# EAGLE design MotherboardV2.0.1 (EAGLE 7.2.0)

## Sheet 1 of 8: LATHCING CIRCUIT
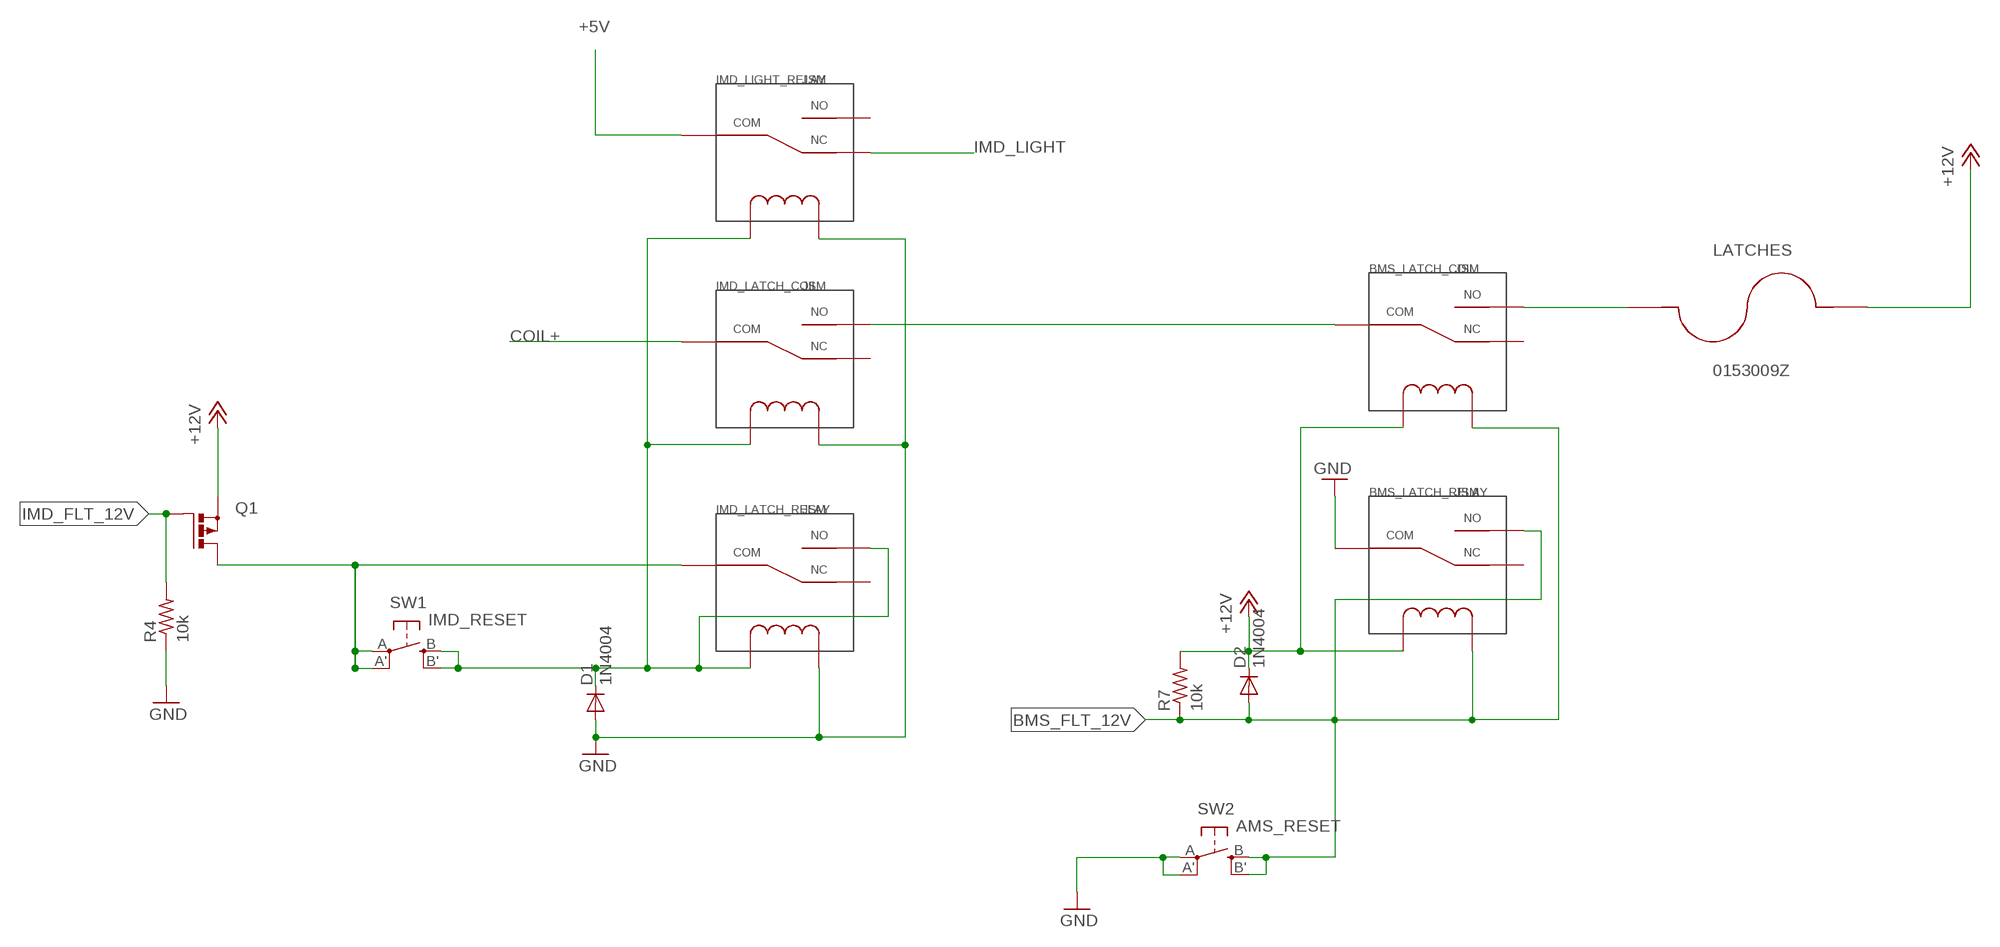
[diagram p0: schematic, sheet 1]

### Parts
BMS_LATCH_COIL  JSM  [JS-M]
BMS_LATCH_RELAY  JSM  [JS-M]
D1  1N4004  [DO41-10]
D2  1N4004  [DO41-10]
IMD_LATCH_COIL  JSM  [JS-M]
IMD_LATCH_RELAY  JSM  [JS-M]
IMD_LIGHT_RELAY  JSM  [JS-M]
LATCHES  0153009Z  [MINIFUSEHOLDER]
Q1  PMOSFET_PTO220BV  [TO220BV]
R4  10k  R-US_0207/9  [0207/9]
R7  10k  R-US_0207/9  [0207/9]
SW1  IMD_RESET  SPST_TACT-EVQQ2  [EVQ-Q2]
SW2  AMS_RESET  SPST_TACT-EVQQ2  [EVQ-Q2]

### Nets
+5V: IMD_LIGHT_RELAY.COM ; also sheet 2,5,6,7
+12V: BMS_LATCH_COIL.COIL1 BMS_LATCH_RELAY.COIL1 D2.C LATCHES.P$2 Q1.S R7.2 ; also sheet 2,3,4,6
BMS_FLT_12V: BMS_LATCH_COIL.COIL2 BMS_LATCH_RELAY.COIL2 BMS_LATCH_RELAY.NO D2.A R7.1 SW2.B'(S1) SW2.B(S) ; also sheet 2,4,7
COIL+: IMD_LATCH_COIL.COM ; also sheet 2
GND: BMS_LATCH_RELAY.COM D1.A IMD_LATCH_COIL.COIL2 IMD_LATCH_RELAY.COIL2 IMD_LIGHT_RELAY.COIL2 R4.1 SW2.A'(P1) SW2.A(P) ; also sheet 2,3,4,5,6,7
IMD_FLT_12V: Q1.G R4.2 ; also sheet 2,7
IMD_LATCH_SW1: IMD_LATCH_RELAY.COM Q1.D SW1.A'(P1) SW1.A(P) ; also sheet 2
IMD_LATCH_SW2: D1.C IMD_LATCH_COIL.COIL1 IMD_LATCH_RELAY.COIL1 IMD_LATCH_RELAY.NO IMD_LIGHT_RELAY.COIL1 SW1.B'(S1) SW1.B(S) ; also sheet 2
IMD_LIGHT: IMD_LIGHT_RELAY.NC
N$11: BMS_LATCH_COIL.COM IMD_LATCH_COIL.NO
N$35: BMS_LATCH_COIL.NO LATCHES.P$1
Unconnected: BMS_LATCH_COIL.NC BMS_LATCH_RELAY.NC IMD_LATCH_COIL.NC IMD_LATCH_RELAY.NC IMD_LIGHT_RELAY.NO

## Sheet 2 of 8: CONNECTORS
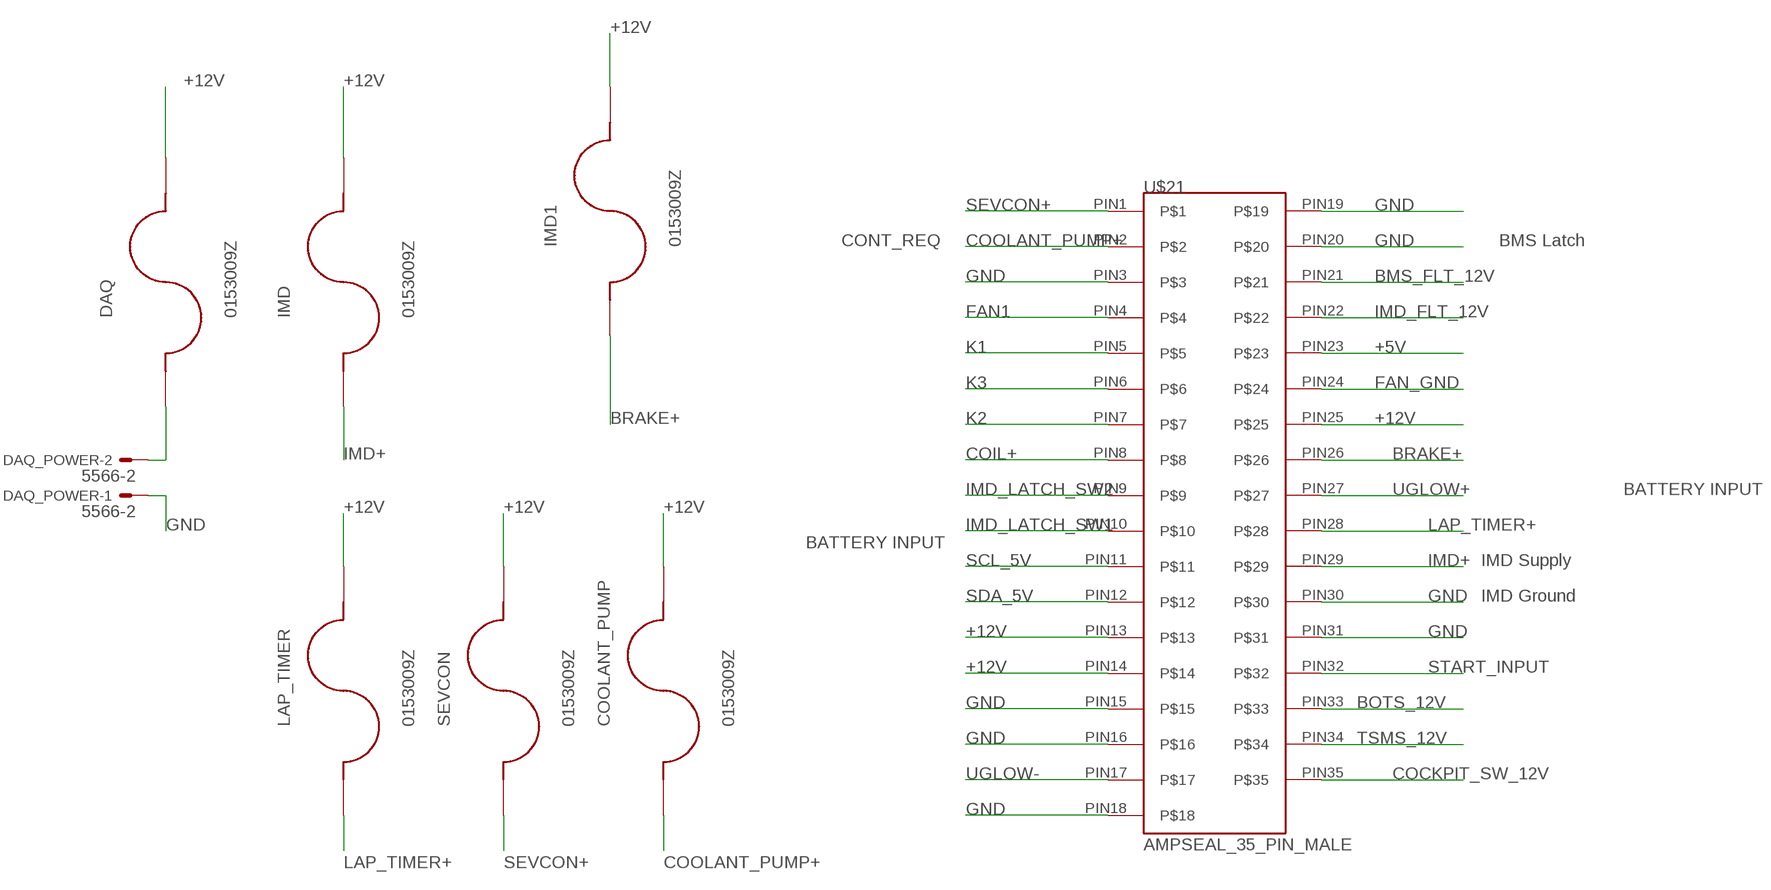
[diagram p1: schematic, sheet 2]

### Parts
COOLANT_PUMP  0153009Z  [MINIFUSEHOLDER]
DAQ  0153009Z  [MINIFUSEHOLDER]
DAQ_POWER  5566-2  [5566-2]
IMD  0153009Z  [MINIFUSEHOLDER]
IMD1  0153009Z  [MINIFUSEHOLDER]
LAP_TIMER  0153009Z  [MINIFUSEHOLDER]
SEVCON  0153009Z  [MINIFUSEHOLDER]
U$21  AMPSEAL_35_PIN_MALE  [AMPSEAL_35_PIN_MALE]

### Nets
+5V: U$21.PIN23 ; also sheet 1,5,6,7
+12V: COOLANT_PUMP.P$2 DAQ.P$2 IMD1.P$2 IMD.P$2 LAP_TIMER.P$2 SEVCON.P$2 U$21.PIN13 U$21.PIN14 U$21.PIN25 ; also sheet 1,3,4,6
BMS_FLT_12V: U$21.PIN21 ; also sheet 1,4,7
BOTS_12V: U$21.PIN33 ; also sheet 7
BRAKE+: IMD1.P$1 U$21.PIN26
COCKPIT_SW_12V: U$21.PIN35 ; also sheet 7
COIL+: U$21.PIN8 ; also sheet 1
COOLANT_PUMP+: COOLANT_PUMP.P$1 U$21.PIN2
DAQ+: DAQ.P$1 DAQ_POWER.2
FAN1: U$21.PIN4 ; also sheet 4
FAN_GND: U$21.PIN24 ; also sheet 4
GND: DAQ_POWER.1 U$21.PIN3 U$21.PIN15 U$21.PIN16 U$21.PIN18 U$21.PIN19 U$21.PIN20 U$21.PIN30 U$21.PIN31 ; also sheet 1,3,4,5,6,7
IMD+: IMD.P$1 U$21.PIN29
IMD_FLT_12V: U$21.PIN22 ; also sheet 1,7
IMD_LATCH_SW1: U$21.PIN10 ; also sheet 1
IMD_LATCH_SW2: U$21.PIN9 ; also sheet 1
K1: U$21.PIN5 ; also sheet 4
K2: U$21.PIN7 ; also sheet 4
K3: U$21.PIN6 ; also sheet 4
LAP_TIMER+: LAP_TIMER.P$1 U$21.PIN28
SCL_5V: U$21.PIN11 ; also sheet 5
SDA_5V: U$21.PIN12 ; also sheet 5
SEVCON+: SEVCON.P$1 U$21.PIN1
START_INPUT: U$21.PIN32 ; also sheet 5
TSMS_12V: U$21.PIN34 ; also sheet 7
UGLOW+: U$21.PIN27 ; also sheet 3
UGLOW-: U$21.PIN17 ; also sheet 3

### Notes on the sheet
- CONT_REQ | BMS Latch
- BATTERY INPUT
- BATTERY INPUT
- IMD Supply
- IMD Ground

## Sheet 3 of 8: OUTPUT RELAYS
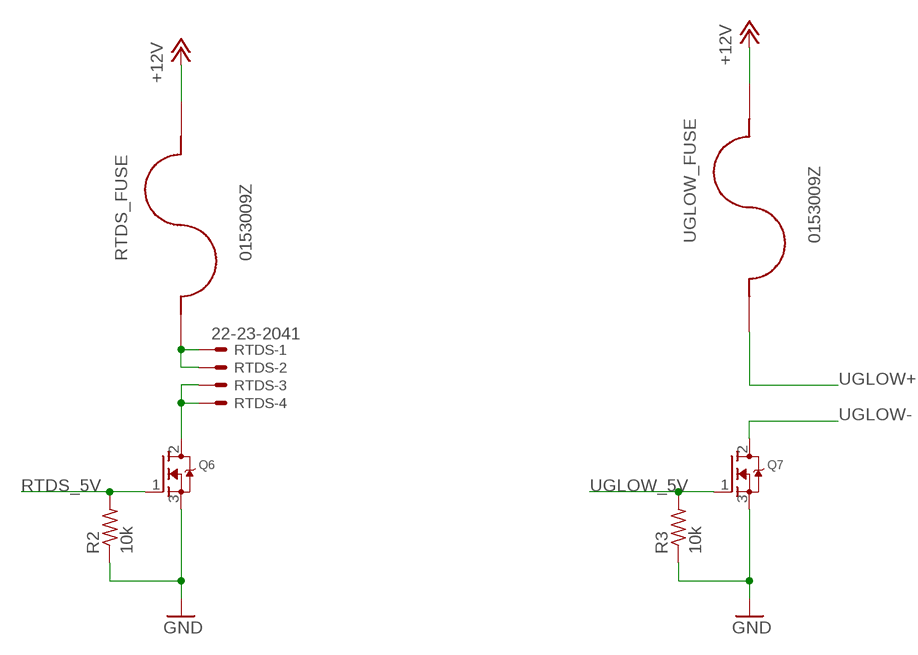
[diagram p2: schematic, sheet 3]

### Parts
Q6  MOSFET-NGDS_TO220V  [TO220V]
Q7  MOSFET-NGDS_TO220V  [TO220V]
R2  10k  R-US_0207/9  [0207/9]
R3  10k  R-US_0207/9  [0207/9]
RTDS  22-23-2041  [22-23-2041]
RTDS_FUSE  0153009Z  [MINIFUSEHOLDER]
UGLOW_FUSE  0153009Z  [MINIFUSEHOLDER]

### Nets
+12V: RTDS_FUSE.P$2 UGLOW_FUSE.P$2 ; also sheet 1,2,4,6
GND: Q6.3(S) Q7.3(S) R2.1 R3.1 ; also sheet 1,2,4,5,6,7
N$1: Q6.2(D) RTDS.3 RTDS.4
N$2: RTDS.1 RTDS.2 RTDS_FUSE.P$1
RTDS_5V: Q6.1(G) R2.2 ; also sheet 5
UGLOW+: UGLOW_FUSE.P$1 ; also sheet 2
UGLOW-: Q7.2(D) ; also sheet 2
UGLOW_5V: Q7.1(G) R3.2 ; also sheet 5

## Sheet 4 of 8: BMS CONNECTORS
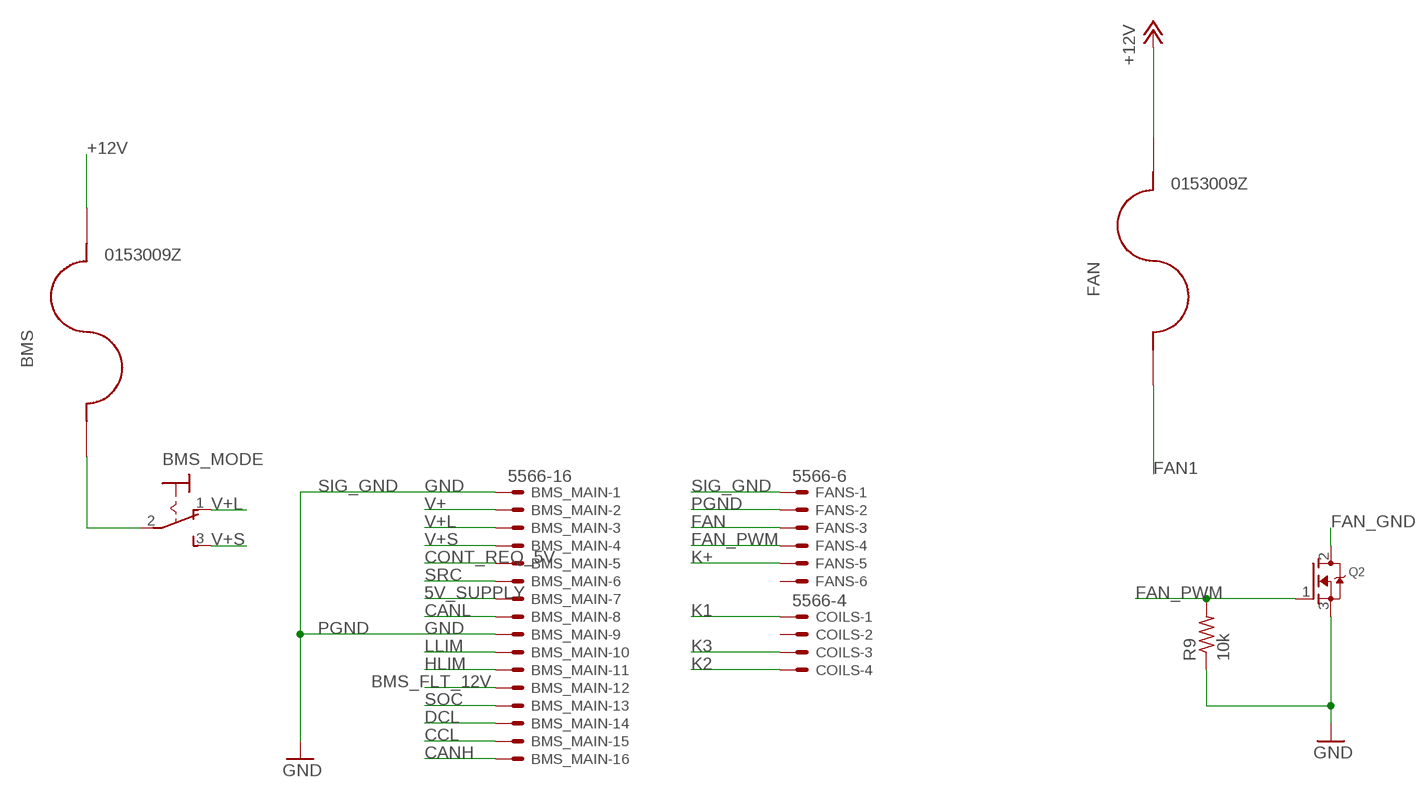
[diagram p3: schematic, sheet 4]

### Parts
BMS  0153009Z  [MINIFUSEHOLDER]
BMS_MAIN  5566-16  [5566-16]
BMS_MODE  320-916  [320-916]
COILS  5566-4  [5566-4]
FAN  0153009Z  [MINIFUSEHOLDER]
FANS  5566-6  [5566-6]
Q2  MOSFET-NGDS_TO220V  [TO220V]
R9  10k  R-US_0207/9  [0207/9]

### Nets
5V_SUPPLY: BMS_MAIN.7
+12V: BMS.P$2 FAN.P$2 ; also sheet 1,2,3,6
BMS_FLT_12V: BMS_MAIN.12 ; also sheet 1,2,7
CANH: BMS_MAIN.16
CANL: BMS_MAIN.8
CCL: BMS_MAIN.15
CONT_REQ_5V: BMS_MAIN.5 ; also sheet 5
DCL: BMS_MAIN.14
FAN: FANS.3
FAN1: FAN.P$1 ; also sheet 2
FAN_GND: Q2.2(D) ; also sheet 2
FAN_PWM: FANS.4 Q2.1(G) R9.2
GND: BMS_MAIN.1 BMS_MAIN.9 Q2.3(S) R9.1 ; also sheet 1,2,3,5,6,7
HLIM: BMS_MAIN.11
K1: COILS.1 ; also sheet 2
K2: COILS.4 ; also sheet 2
K3: COILS.3 ; also sheet 2
K+: FANS.5
LLIM: BMS_MAIN.10
N$3: BMS.P$1 BMS_MODE.2(P)
PGND: FANS.2
SIG_GND: FANS.1
SOC: BMS_MAIN.13 ; also sheet 5
SRC: BMS_MAIN.6
V+: BMS_MAIN.2
V+L: BMS_MAIN.3 BMS_MODE.1(O)
V+S: BMS_MAIN.4 BMS_MODE.3(S)
Unconnected: COILS.2 FANS.6

### Notes on the sheet
- SIG_GND
- PGND

## Sheet 5 of 8: VCU
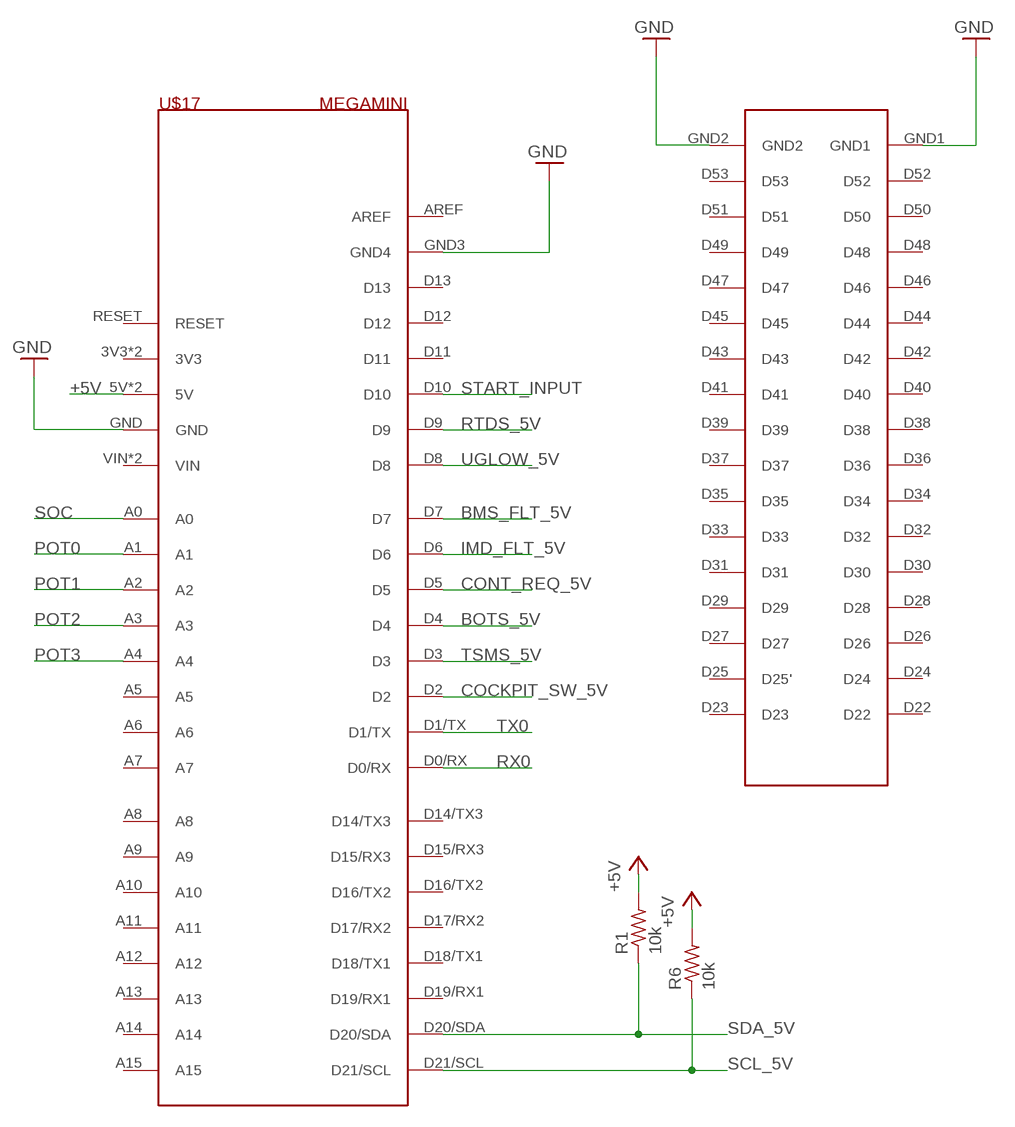
[diagram p4: schematic, sheet 5]

### Parts
R1  10k  R-US_0207/9  [0207/9]
R6  10k  R-US_0207/9  [0207/9]
U$17  MEGAMINI  [MEGAMINI]

### Nets
+5V: R1.2 R6.2 U$17.5V U$17.5V_2(5V) ; also sheet 1,2,6,7
BMS_FLT_5V: U$17.D7 ; also sheet 7
BOTS_5V: U$17.D4 ; also sheet 7
COCKPIT_SW_5V: U$17.D2 ; also sheet 7
CONT_REQ_5V: U$17.D5 ; also sheet 4
GND: U$17.GND U$17.GND1 U$17.GND2 U$17.GND3(GND4) ; also sheet 1,2,3,4,6,7
IMD_FLT_5V: U$17.D6 ; also sheet 7
POT0: U$17.A1
POT1: U$17.A2
POT2: U$17.A3
POT3: U$17.A4
RTDS_5V: U$17.D9 ; also sheet 3
RX0: U$17.D0/RX
SCL_5V: R6.1 U$17.D21/SCL ; also sheet 2
SDA_5V: R1.1 U$17.D20/SDA ; also sheet 2
SOC: U$17.A0 ; also sheet 4
START_INPUT: U$17.D10 ; also sheet 2
TSMS_5V: U$17.D3 ; also sheet 7
TX0: U$17.D1/TX
UGLOW_5V: U$17.D8 ; also sheet 3
Unconnected: U$17.3V3 U$17.3V3_2(3V3) U$17.A5 U$17.A6 U$17.A7 U$17.A8 U$17.A9 U$17.A10 U$17.A11 U$17.A12 U$17.A13 U$17.A14 U$17.A15 U$17.AREF U$17.D11 U$17.D12 U$17.D13 U$17.D14/TX3 U$17.D15/RX3 U$17.D16/TX2 U$17.D17/RX2 U$17.D18/TX1 U$17.D19/RX1 U$17.D22 U$17.D23 U$17.D24 U$17.D25(D25') U$17.D26 U$17.D27 U$17.D28 U$17.D29 U$17.D30 U$17.D31 U$17.D32 U$17.D33 U$17.D34 U$17.D35 U$17.D36 U$17.D37 U$17.D38 U$17.D39 U$17.D40 U$17.D41 U$17.D42 U$17.D43 U$17.D44 U$17.D45 U$17.D46 U$17.D47 U$17.D48 U$17.D49 U$17.D50 U$17.D51 U$17.D52 U$17.D53 U$17.RESET U$17.VIN U$17.VIN_2(VIN)

## Sheet 6 of 8: REGULATORS
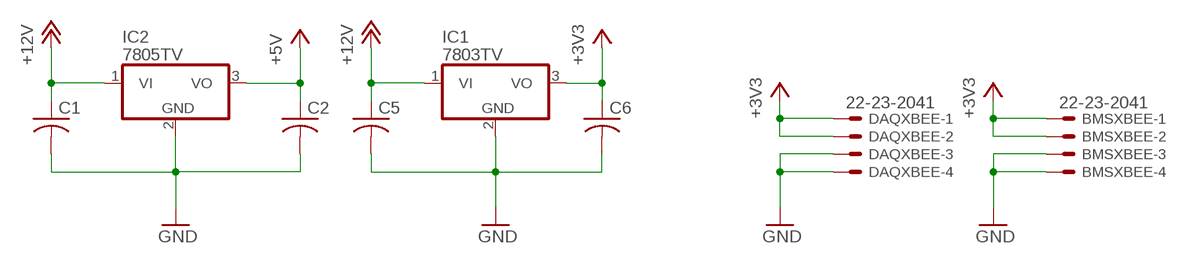
[diagram p5: schematic, sheet 6]

### Parts
BMSXBEE  22-23-2041  [22-23-2041]
C1  C-US050-024X044  [C050-024X044]
C2  C-US050-024X044  [C050-024X044]
C5  C-US050-024X044  [C050-024X044]
C6  C-US050-024X044  [C050-024X044]
DAQXBEE  22-23-2041  [22-23-2041]
IC1  7803TV  7805TV  [TO220V]
IC2  7805TV  [TO220V]

### Nets
+3V3: BMSXBEE.1 BMSXBEE.2 C6.1 DAQXBEE.1 DAQXBEE.2 IC1.3(VO)
+5V: C2.1 IC2.3(VO) ; also sheet 1,2,5,7
+12V: C1.1 C5.1 IC1.1(VI) IC2.1(VI) ; also sheet 1,2,3,4
GND: BMSXBEE.3 BMSXBEE.4 C1.2 C2.2 C5.2 C6.2 DAQXBEE.3 DAQXBEE.4 IC1.2(GND) IC2.2(GND) ; also sheet 1,2,3,4,5,7

## Sheet 7 of 8: LEVEL SHIFTING
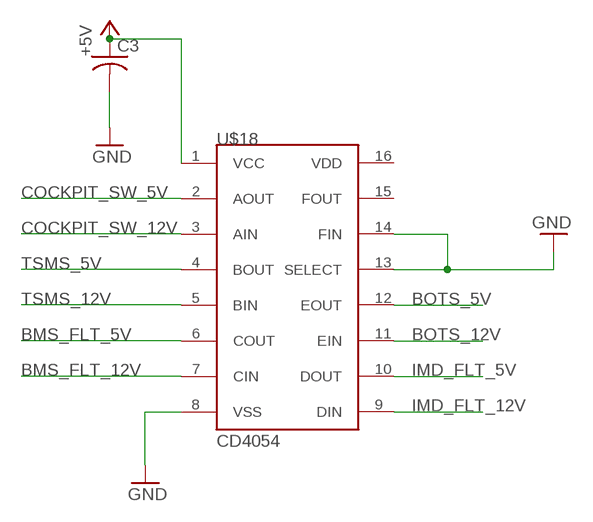
[diagram p6: schematic, sheet 7]

### Parts
C3  C-US050-024X044  [C050-024X044]
U$18  CD4054  [DIL16]

### Nets
+5V: C3.1 U$18.1(VCC) ; also sheet 1,2,5,6
BMS_FLT_5V: U$18.6(COUT) ; also sheet 5
BMS_FLT_12V: U$18.7(CIN) ; also sheet 1,2,4
BOTS_5V: U$18.12(EOUT) ; also sheet 5
BOTS_12V: U$18.11(EIN) ; also sheet 2
COCKPIT_SW_5V: U$18.2(AOUT) ; also sheet 5
COCKPIT_SW_12V: U$18.3(AIN) ; also sheet 2
GND: C3.2 U$18.8(VSS) U$18.13(SELECT) U$18.14(FIN) ; also sheet 1,2,3,4,5,6
IMD_FLT_5V: U$18.10(DOUT) ; also sheet 5
IMD_FLT_12V: U$18.9(DIN) ; also sheet 1,2
TSMS_5V: U$18.4(BOUT) ; also sheet 5
TSMS_12V: U$18.5(BIN) ; also sheet 2
Unconnected: U$18.15(FOUT) U$18.16(VDD)

## Sheet 8 of 8

## Library data of the parts
BMS COOLANT_PUMP DAQ FAN IMD IMD1 LAP_TIMER LATCHES RTDS_FUSE SEVCON UGLOW_FUSE = littelfuse:0153009Z: http://www.digikey.com/product-search/en/circuit-protection/fuseholders/655422?k=01530009 MINI ATC, MINI ATO Blade fuse holder
BMS_LATCH_COIL BMS_LATCH_RELAY IMD_LATCH_COIL IMD_LATCH_RELAY IMD_LIGHT_RELAY = panasonic:JSM
BMS_MAIN = con-molex:5566-16: Mini FIT connector 16 pol Source: http://www.molex.com; OC_FARNELL: unknown; OC_NEWARK: unknown
BMS_MODE = switch:320-916: TOGGLE SWITCH distributor RS Components
BMSXBEE DAQXBEE RTDS = con-molex:22-23-2041: .100" (2.54mm) Center Header - 4 Pin; MF: MOLEX; MPN: 22-23-2041; OC_FARNELL: 1462920; OC_NEWARK: 38C0355
C1-C3 C5 C6 = adafruit:C-US: CAPACITOR, American symbol
COILS = con-molex:5566-4: Mini FIT connector 4 pol Source: http://www.molex.com; OC_FARNELL: unknown; OC_NEWARK: unknown
D1 D2 = adafruit:1N4004: DIODE General purpose 1N400x type rectifier (With bigger pads) http://www.ladyada.net/library/pcb/eaglelibrary.html
DAQ_POWER = con-molex:5566-2: Mini FIT connector 2 pol Source: http://www.molex.com; OC_FARNELL: 1822072; OC_NEWARK: unknown
FANS = con-molex:5566-6: Mini FIT connector 6 pol Source: http://www.molex.com; MPN: 95566-61002; OC_FARNELL: unknown; OC_NEWARK: 22K8620
IC1 IC2 = linear:78*: Positive VOLTAGE REGULATOR Source: http://cache.national.com/ds/LM/LM78L05.pdf http://www.fairchildsemi.com/ds/LM/LM7805.pdf
Q1 = transistor-power:PMOSFET_P: Power MOSFET P-Channel
Q2 Q6 Q7 = adafruit:MOSFET-N: N-Channel Mosfet 2N7002E - 60V 260mA SOT23 [Digikey: 2N7002ET1GOSTR-ND] - REEL BSH103 - 30V 850mA SOT23 [Digikey: 568-5013-1-ND]
R1-R4 R6 R7 R9 = adafruit:R-US_: RESISTOR, American symbol
SW1 SW2 = adafruit:SPST_TACT: SMT 6mm switch, EVQQ2 series http://www.ladyada.net/library/eagle
U$17 = Mega-mini:MEGAMINI
U$18 = texas:CD4054
U$21 = AMPSEAL 35 PIN MALE:AMPSEAL_35_PIN_MALE

## Board
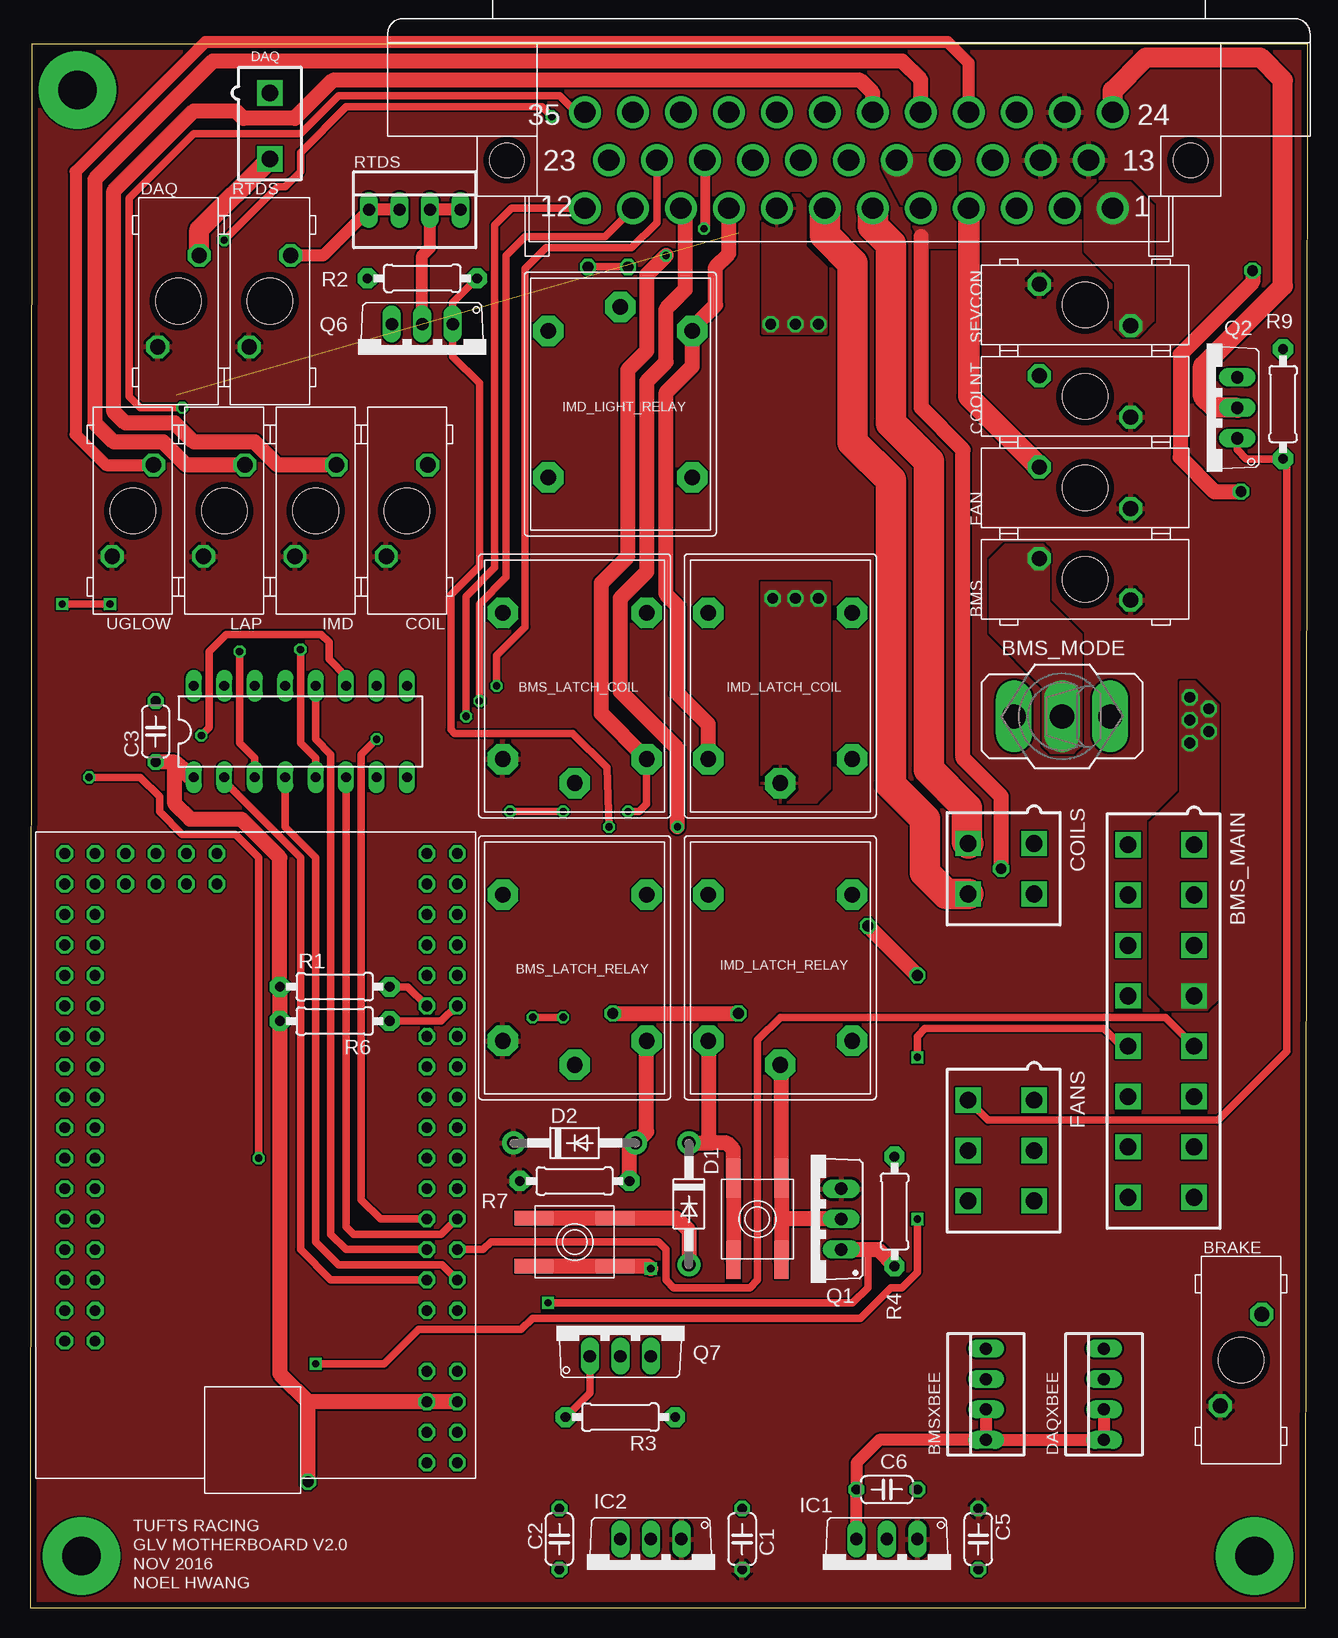
[diagram p7: board, top side]
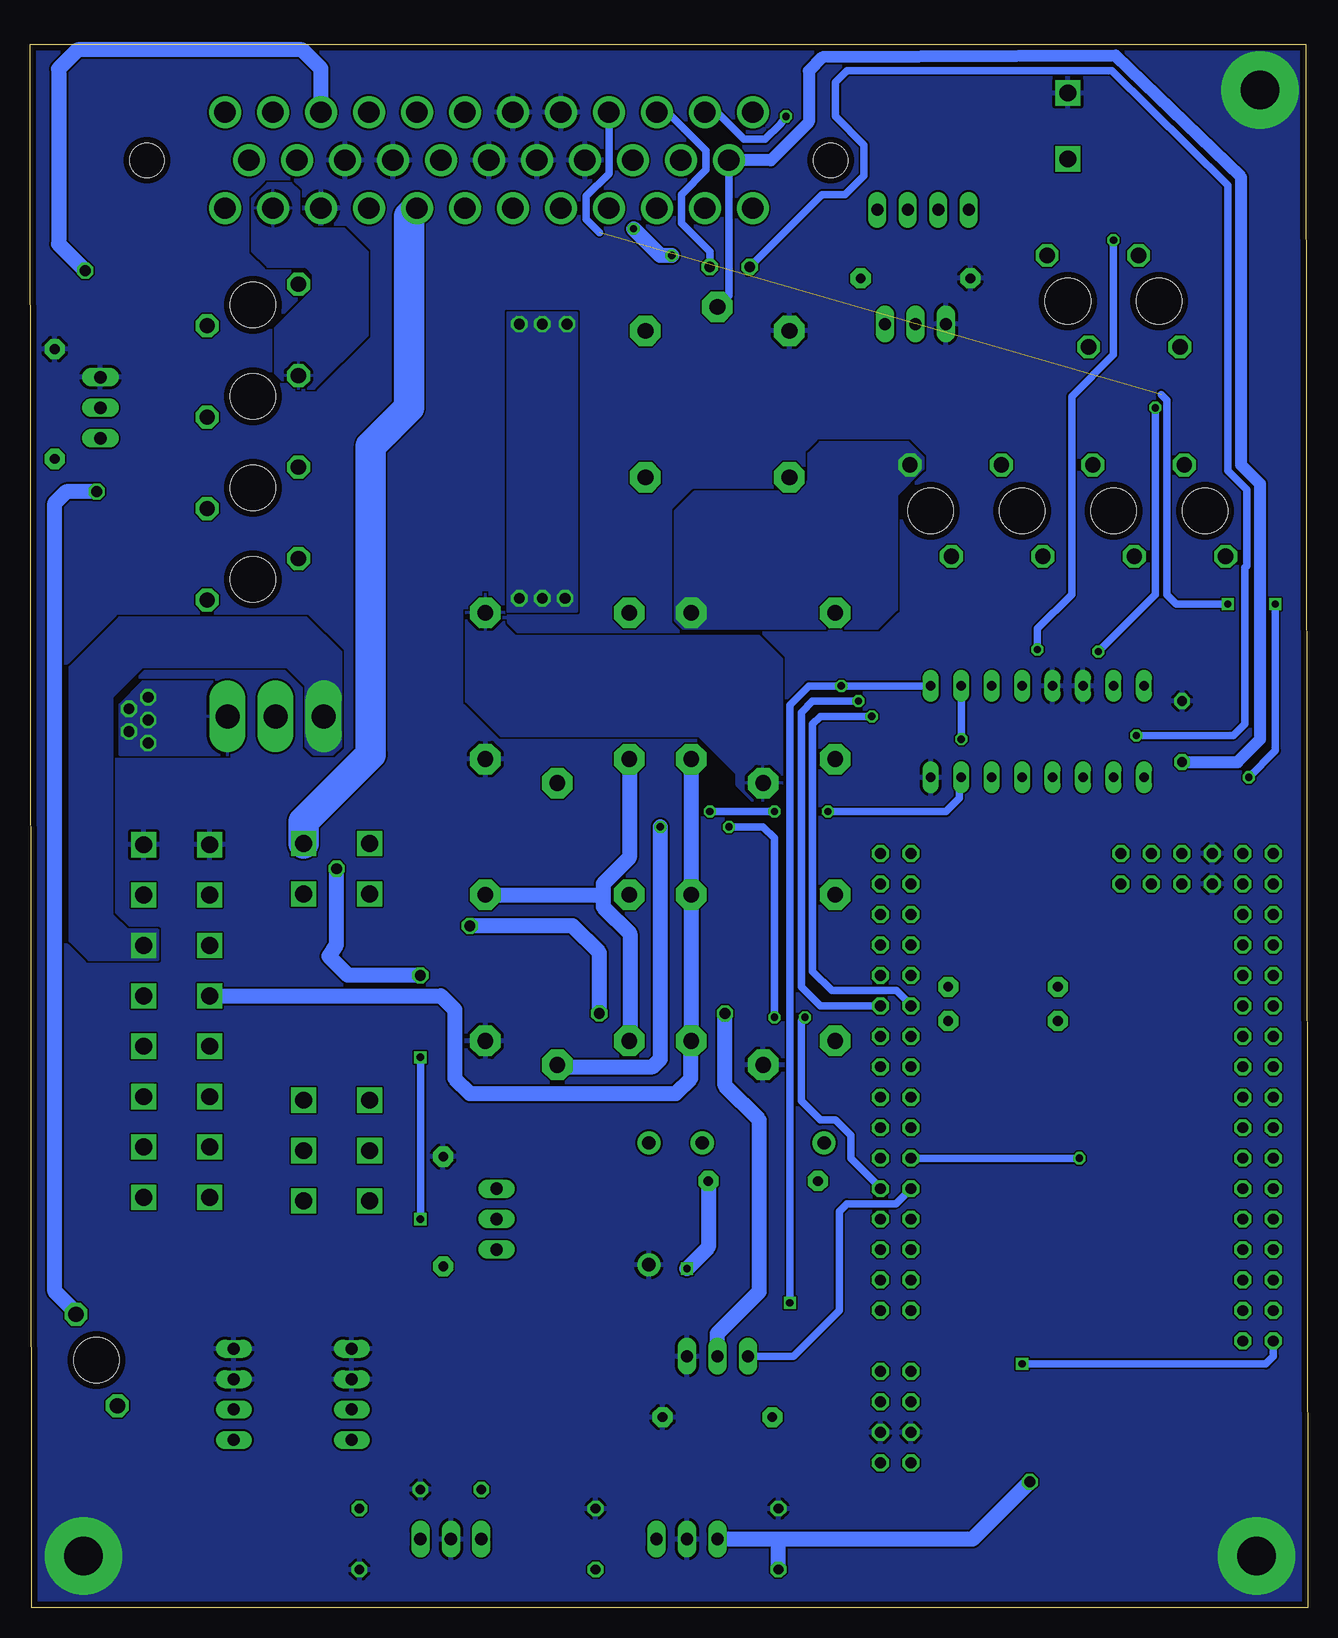
[diagram p8: board, bottom side, seen from below]

Size 106.52 x 130.33 mm. Coordinates in mm from the lower left corner, seen from the top.
Outline: 0,0 106.36,0 106.52,130.33 0.16,130.33 0,0
Copper layers (1*16): Top 0.035mm / dielectric 1.5mm / Bottom 0.035mm
Design rules "3pcb": minimum track width 6mil, minimum drill 8mil, track to track 6mil, track to pad 6mil, pad to pad 6mil, via to via 6mil, smd to smd 6mil, copper to edge 20mil, drill to drill 6mil, minimum pad ring 10mil, minimum via ring 8mil, stop-mask expansion 4mil, vias tented up to drill 0mil, thermal gap 10mil

### Footprints (pad centres in the part's own frame; a part is rotated, then mirrored left to right if it is on the bottom)
MINIFUSEHOLDER = drill 1.27 octagon: P$1 1.727,3.81; P$2 -1.727,-3.81 | hole 3.785: 0,0
JS-M = drill 1.3 pad 2.54 octagon: COIL1 -6.1,6; COIL2 -6.1,-6; COM -8.1,0; NC 6.1,6; NO 6.1,-6
5566-16 = drill 1.4 square: 1 14.7,-2.75; 2 10.5,-2.75; 3 6.3,-2.75; 4 2.1,-2.75; 5 -2.1,-2.75; 6 -6.3,-2.75; 7 -10.5,-2.75; 8 -14.7,-2.75; 9 14.7,2.75; 10 10.5,2.75; 11 6.3,2.75; 12 2.1,2.75; 13 -2.1,2.75; 14 -6.3,2.75; 15 -10.5,2.75; 16 -14.7,2.75
320-916 = drill 2.007 long: 1 0,4.013; 2 0,0; 3 0,-4.013
22-23-2041 = drill 1 long: 1 -3.81,0; 2 -1.27,0; 3 1.27,0; 4 3.81,0
C050-024X044 = drill 0.813 octagon: 1 -2.54,0; 2 2.54,0
5566-4 = drill 1.4 square: 1 2.1,-2.75; 2 -2.1,-2.75; 3 2.1,2.75; 4 -2.1,2.75
DO41-10 = drill 1.118 pad 1.93: A 5.08,0; C -5.08,0
5566-2 = drill 1.4 square: 1 0,-2.75; 2 0,2.75
5566-6 = drill 1.4 square: 1 4.2,-2.75; 2 0,-2.75; 3 -4.2,-2.75; 4 4.2,2.75; 5 0,2.75; 6 -4.2,2.75
TO220V = drill 1.016 long: 1 -2.54,-2.54; 2 0,-2.54; 3 2.54,-2.54
TO220BV = drill 1.016 long: D 0,-2.54; G -2.54,-2.54; S 2.54,-2.54
0207/9 = drill 0.813 pad 1.676 octagon: 1 -4.572,0; 2 4.572,0
EVQ-Q2 = smd 3.2 x 1.2: A -3.4,-2; A' 3.4,-2; B -3.4,2; B' 3.4,2
MEGAMINI = drill 0.9 octagon: 3V3 8.89,1.524; 3V3_2 8.89,4.064; 5V 6.35,1.524; 5V_2 6.35,4.064; A0 11.43,34.264; A1 11.43,31.724; A2 13.97,34.264; A3 13.97,31.724; A4 16.51,34.264; A5 16.51,31.724; A6 19.05,34.264; A7 19.05,31.724; A8 21.59,34.264; A9 21.59,31.724; A10 24.13,34.264; A11 24.13,31.724; A12 26.67,34.264; A13 26.67,31.724; A14 29.21,34.264; A15 29.21,31.724; AREF 31.75,34.264; D0/RX 13.97,4.064; D1/TX 13.97,1.524; D2 16.51,4.064; D3 16.51,1.524; D4 19.05,4.064; D5 19.05,1.524; D6 21.59,4.064; D7 21.59,1.524; D8 24.13,4.064; D9 24.13,1.524; D10 26.67,4.064; D11 26.67,1.524; D12 29.21,4.064; D13 29.21,1.524; D14/TX3 31.75,4.064; D15/RX3 31.75,1.524; D16/TX2 34.29,4.064; D17/RX2 34.29,1.524; D18/TX1 36.83,4.064; D19/RX1 36.83,1.524; D20/SDA 39.37,4.064; D21/SCL 39.37,1.524; D22 41.91,4.064; D23 41.91,1.524; D24 44.45,4.064; D25 44.45,1.524; D26 46.99,4.064; D27 46.99,1.524; D28 49.53,4.064; D29 49.53,1.524; D30 52.07,4.064; D31 52.07,1.524; D32 34.29,34.264; D33 34.29,31.724; D34 36.83,34.264; D35 36.83,31.724; D36 39.37,34.264; D37 39.37,31.724; D38 41.91,34.264; D39 41.91,31.724; D40 44.45,34.264; D41 44.45,31.724; D42 46.99,34.264; D43 46.99,31.724; D44 49.53,34.264; D45 49.53,31.724; D46 52.07,34.264; D47 52.07,31.724; D48 52.07,26.644; D49 49.53,26.644; D50 52.07,24.104; D51 49.53,24.104; D52 52.07,21.564; D53 49.53,21.564; GND 49.53,29.184; GND1 52.07,29.184; GND2 3.81,4.064; GND3 3.81,1.524; RESET 31.75,31.724; VIN 1.27,1.524; VIN_2 1.27,4.064
DIL16 = drill 0.813 long: 1 -8.89,-3.81; 2 -6.35,-3.81; 3 -3.81,-3.81; 4 -1.27,-3.81; 5 1.27,-3.81; 6 3.81,-3.81; 7 6.35,-3.81; 8 8.89,-3.81; 9 8.89,3.81; 10 6.35,3.81; 11 3.81,3.81; 12 1.27,3.81; 13 -1.27,3.81; 14 -3.81,3.81; 15 -6.35,3.81; 16 -8.89,3.81
AMPSEAL_35_PIN_MALE = drill 1.778 pad 2.54: PIN1 -22,4; PIN2 -18,4; PIN3 -14,4; PIN4 -10,4; PIN5 -6,4; PIN6 -2,4; PIN7 2,4; PIN8 6,4; PIN9 10,4; PIN10 14,4; PIN11 18,4; PIN12 22,4; PIN13 -20,0; PIN14 -16,0; PIN15 -12,0; PIN16 -8,0; PIN17 -4,0; PIN18 0,0; PIN19 4,0; PIN20 8,0; PIN21 12,0; PIN22 16,0; PIN23 20,0; PIN24 -22,-4; PIN25 -18,-4; PIN26 -14,-4; PIN27 -10,-4; PIN28 -6,-4; PIN29 -2,-4; PIN30 2,-4; PIN31 6,-4; PIN32 10,-4; PIN33 14,-4; PIN34 18,-4; PIN35 22,-4 | hole 2.85: -28.5,0; 28.5,0

### Placement (x,y rotation side)
BMS  87.95,85.72 90 top
BMS_LATCH_COIL  45.4,76.83 90 top
BMS_LATCH_RELAY  45.4,53.34 90 top
BMS_MAIN  94.3,48.9 90 top
BMS_MODE  86.04,74.3 90 top
BMSXBEE  79.69,17.78 90 top
C1  59.37,5.71 90 top
C2  44.13,5.71 90 top
C3  10.48,73.03 90 top
C5  79.06,5.71 270 top
C6  71.44,9.84 0 top
COILS  80.96,61.59 90 top
COOLANT_PUMP  87.95,100.97 90 top
D1  54.93,33.66 270 top
D2  45.4,38.73 0 top
DAQ  12.38,108.9 0 top
DAQ_POWER  20,123.51 180 top
DAQXBEE  89.53,17.78 90 top
FAN  87.95,93.34 90 top
FANS  80.96,38.1 90 top
IC1  71.44,3.17 180 top
IC2  51.75,3.17 180 top
IMD  23.81,91.44 0 top
IMD1  100.97,20.64 0 top
IMD_LATCH_COIL  62.55,76.83 90 top
IMD_LATCH_RELAY  62.55,53.34 90 top
IMD_LIGHT_RELAY  49.21,100.33 270 top
LAP_TIMER  16.19,91.44 0 top
LATCHES  31.43,91.44 0 top
Q1  65.09,32.38 90 top
Q2  98.11,100.01 90 top
Q6  32.7,104.46 180 top
Q7  49.21,23.5 0 top
R1  25.4,51.75 180 top
R2  32.7,110.81 0 top
R3  49.21,15.88 180 top
R4  72.07,33.02 270 top
R6  25.4,48.9 180 top
R7  45.4,35.56 180 top
R9  104.46,100.33 270 top
RTDS  32.07,116.52 0 top
RTDS_FUSE  20,108.9 0 top
SEVCON  87.95,108.58 270 top
SW1  60.64,32.38 90 top
SW2  45.4,30.48 180 top
U$17  37.15,10.79 90 top
U$18  22.54,73.03 0 top
U$21  68.26,120.65 180 top
UGLOW_FUSE  8.57,91.44 0 top

### Tracks (layer width: path | path; a pad name or v marks a point on that pad's centre or on a via)
+3V3
  Top 1.016: IC1.3 C6.1 68.9,12.06 70.8,13.97 BMSXBEE.1 | BMSXBEE.1 DAQXBEE.1 DAQXBEE.2 | BMSXBEE.2 BMSXBEE.1
+5V  (via drill 0.6, 0.9)
  Top 1.27: v23.18,10.48 23.18,16.83 23.34,16.99 | U$17.5V U$17.5V_2 23.5,17.14 23.34,16.99 | 12.06,70.48 12.06,66.99 13.34,65.72 17.62,65.72 20.83,62.52 R1.2 R6.2 20.83,19.49 23.34,16.99 | 12.06,70.48 U$18.1 13.34,69.22 12.06,70.48 | 12.06,70.48 C3.1
  Bottom 0.61: U$21.PIN23 48.26,109.38 IMD_LIGHT_RELAY.COM
  Bottom 1.016: U$21.PIN23 44.77,120.65 41.59,123.83 41.59,128.11 40.48,129.22 16.03,129.38 5.56,119.22 5.56,95.25 3.97,93.66 3.97,72.39 5.87,70.48 C3.1
  Bottom 1.27: v23.18,10.48 27.94,5.71 43.82,5.71 | 43.82,5.71 IC2.3 | C2.1 44.13,5.4 43.82,5.71
  other vias: 10.48,70.48
+12V
  pour Top (rank 2): -1.59,135.57 -1.59,-20.64 110.17,-20.32 110.17,135.89
BMS_FLT_5V
  Top 0.61: U$18.6 26.35,31.75 26.99,31.11 34.29,31.11 35.56,32.38 U$17.D7
BMS_FLT_12V  (via drill 0.6)
  Top 0.61: BMS_LATCH_COIL.COIL2 51.4,66.99 50.77,66.36 v49.85,66.36 | v44.45,66.36 v40,66.36
  Top 0.813: U$21.PIN21 56.26,115 v56.2,114.94
  Top 1.27: SW2.B' SW2.B 51.53,28.48 v51.75,28.26 | R7.1 49.97,38.23 D2.A 51.4,39.66 BMS_LATCH_RELAY.COIL2 | BMS_LATCH_COIL.COIL2 47.63,74.51 47.63,85.41 49.85,87.63 49.85,103.19 51.43,104.78 51.43,111.12 v53.02,112.71
  Bottom 0.61: v49.85,66.36 v44.45,66.36 | v40,66.36 30.16,66.36 29.05,67.47 29.05,69.06 U$18.7
  Bottom 1.27: R7.1 49.97,30.04 v51.75,28.26 | BMS_LATCH_COIL.COIL2 BMS_LATCH_RELAY.NO BMS_LATCH_RELAY.COIL2 51.43,47.27 51.43,44.13 52.71,42.86 69.85,42.86 71.12,44.13 71.12,49.85 72.27,50.99 BMS_MAIN.12 | v53.02,112.71 53.97,112.71 v56.2,114.94
BOTS_5V
  Top 0.61: U$18.12 23.81,72.39 25.08,71.12 25.08,31.11 26.35,29.84 U$17.D4
BOTS_12V  (via drill 0.6, 0.9)
  Top 0.61: v49.85,111.76 v46.51,111.76 | U$18.11 26.35,77.63 24.92,79.06 24.92,80.49 24.29,81.12 16.35,81.12 14.92,79.69 14.92,73.34 v14.29,72.71
  Bottom 0.61: U$21.PIN33 53.37,124.65 50.17,121.44 50.17,119.86 52.23,117.79 52.23,115.41 49.85,113.03 v49.85,111.76 | v46.51,111.76 40.48,117.79 38.58,117.79 36.99,119.38 36.99,121.92 39.37,124.3 39.37,127.16 38.42,128.11 16.35,128.11 6.67,118.59 6.67,94.77 5.08,93.19 5.08,86.84 5.24,86.68 5.24,73.66 6.19,72.71 v14.29,72.71
BRAKE+  (via drill 0.9)
  Top 1.27: v101.92,111.44 101.92,110.49 95.88,104.46 95.88,95.89 98.74,93.03 v100.97,93.03
  Bottom 1.27: IMD1.P$1 102.55,24.45 104.46,26.35 104.46,92.08 103.5,93.03 v100.97,93.03 | U$21.PIN26 82.26,128.3 83.82,129.86 102.55,129.86 104.14,128.27 104.14,113.67 v101.92,111.44
COCKPIT_SW_5V
  Top 0.61: U$18.2 16.19,68.9 22.54,62.55 22.54,29.84 25.08,27.3 U$17.D2
COCKPIT_SW_12V  (via drill 0.6)
  Top 0.61: U$18.3 18.73,70.8 17.46,72.07 v17.46,79.69 | U$21.PIN35 45.53,124.65 44.13,126.05 25.72,126.05 22.54,122.87 13.65,122.87 8.25,117.47 8.25,100.97 9.21,100.01 v12.7,100.01
  Bottom 0.61: v12.7,100.01 12.7,84.45 v17.46,79.69
COIL+  (via drill 0.9)
  other vias: 61.75,107 63.82,107 65.72,107 61.91,84.14 63.82,84.14 65.72,84.14
  pour Top: 60.96,85.41 60.96,68.26 62.07,67.15 65.56,67.15 66.67,68.26 66.67,85.41
  pour Top: 61.12,106.2 61.12,117.32 61.59,117.79 64.14,117.79 64.61,117.32 64.61,113.51 66.36,111.76 66.36,106.2
  pour Bottom: 60.96,83.03 66.67,83.03 66.67,107.95 60.96,107.95
CONT_REQ_5V
  Top 0.61: U$17.D5 37.78,29.84 38.42,30.48 52.39,30.48 53.02,29.84 53.02,27.3 53.66,26.67 60.01,26.67 60.64,27.3 60.64,47.31 62.55,49.21 94.63,49.21 BMS_MAIN.5
COOLANT_PUMP+
  pour Bottom: 82.87,101.6 84.77,101.6 86.04,102.87 86.04,106.68 82.87,109.86 82.87,111.12 83.5,111.76 86.68,111.76 87.95,113.03 87.95,117.47 86.68,118.75 84.77,118.75 84.14,118.11 84.14,116.2 82.87,114.94 80.33,114.94 78.42,113.03 78.42,106.05
DAQ+
  Top 1.676: DAQ.P$1 14.11,114.86 DAQ_POWER.2
FAN1
  Top 1.778: U$21.PIN4 78.26,100.95 FAN.P$1
FAN_GND
  Top 1.676: Q2.2 98.74,100.01 97.79,100.97 97.79,103.5 104.46,110.17 104.46,127.32 102.55,129.22 93.03,129.22 90.26,126.46 U$21.PIN24
FAN_PWM
  Top 0.61: Q2.1 100.65,96.52 101.41,95.76 R9.2 104.77,95.76 104.77,46.35 99.06,40.64 79.87,40.64 FANS.4
GND  (via drill 3.2 pad 6.45)
  Top 1.27: SW2.A' SW2.A 53.88,32.48 54.93,31.43 D1.A
  other vias: 4.29,4.29 102.08,4.29 3.97,126.52
  pour Bottom (rank 2): -3.81,132.4 106.36,132.08 106.36,-25.4 -3.81,-25.08
IMD+
  Top 1.27: U$21.PIN29 70.26,126.27 69.22,127.32 25.24,127.32 22.07,124.14 17.78,124.14 17.14,124.78 13.65,124.78 6.99,118.11 6.99,99.69 7.94,98.74 12.06,98.74 13.65,97.16 18.73,97.16 20.64,95.25 IMD.P$1
IMD_FLT_5V  (via drill 0.6)
  Top 0.61: U$17.D6 29.21,32.38 27.62,33.97 27.62,71.12 28.18,71.68 v28.89,72.39
  Bottom 0.61: U$18.10 v28.89,72.39
IMD_FLT_12V  (via drill 0.6)
  Top 0.61: v43.18,25.4 68.58,25.4 69.85,26.67 69.85,29.84 | v38.89,76.83 38.89,79.38 41.28,81.76 41.28,111.6 43.02,113.35 50.17,113.35 52.26,115.44 U$21.PIN22
  Top 1.27: Q1.G 69.85,29.84 70.68,29.84 R4.2
  Bottom 0.61: U$18.9 v38.89,76.83 41.59,76.83 43.18,75.25 v43.18,25.4
IMD_LATCH_SW1  (via drill 0.6)
  Top 1.27: 62.64,32.38 SW1.A' 62.64,45.24 IMD_LATCH_RELAY.COM | SW1.A 62.64,32.07 62.64,32.38 | v53.97,65.09 53.97,71.6 49.21,76.36 49.21,84.14 51.43,86.36 51.43,102.23 53.02,103.82 53.02,108.27 54.61,109.86 54.61,116.3 U$21.PIN10 | Q1.D 62.64,32.38
  Bottom 1.27: IMD_LATCH_RELAY.COM 62.39,45.09 54.61,45.09 53.97,45.72 v53.97,65.09
IMD_LATCH_SW2
  Top 1.27: SW1.B SW1.B' 58.64,38.2 58.1,38.73 56.83,38.73 | D1.C 56.83,38.73 | IMD_LATCH_RELAY.COIL1 56.55,39.02 56.83,38.73 | IMD_LATCH_RELAY.NO 68.48,59.37 | U$21.PIN9 58.26,112.87 57.15,111.76 57.15,108.58 55.21,106.65 IMD_LIGHT_RELAY.COIL1 55.21,103.47 53.02,101.28 53.02,84.45 53.97,83.5 53.97,76.2 56.55,73.63 IMD_LATCH_COIL.COIL1
  Bottom 1.27: IMD_LATCH_COIL.COIL1 56.55,62.52 58.74,60.33 58.74,59.37 | 58.74,59.37 58.74,58.42 56.51,56.2 56.51,47.27 IMD_LATCH_RELAY.COIL1 | 58.74,59.37 68.48,59.37 IMD_LATCH_RELAY.NO
K1
  Bottom 2.54: COILS.1 83.71,65.51 78.1,71.12 78.1,96.84 74.93,100.01 74.93,115.98 U$21.PIN5
K2
  Top 2.54: U$21.PIN7 66.26,114.39 68.58,112.08 68.58,97.16 71.75,93.98 71.75,68.58 74.61,65.72 74.61,61.28 76.39,59.49 COILS.4
K3
  Top 2.54: U$21.PIN6 70.26,115.16 71.75,113.67 71.75,98.74 74.93,95.57 74.93,69.85 78.1,66.67 78.1,63.8 COILS.3
LAP_TIMER+
  Top 1.27: U$21.PIN28 74.26,127.35 72.71,128.91 15.24,128.91 5.4,119.06 5.4,98.74 6.99,97.16 11.11,97.16 13.02,95.25 LAP_TIMER.P$1
N$1
  Top 1.016: RTDS.4 RTDS.3 33.34,113.35 32.7,112.71 Q6.2
N$2
  Top 1.016: RTDS.2 RTDS.1 24.43,112.71 RTDS_FUSE.P$1
N$3
  pour Top (no thermals): 84.45,76.83 84.45,72.39 84.45,71.91 85.09,71.28 86.99,71.28 87.63,71.91 87.63,81.12 85.09,83.66 84.93,83.82 84.93,88.11 84.45,88.58 81.28,88.58 80.01,87.31 80.01,81.28
N$11
  pour Bottom: 43.81,68.26 43.81,79.06 45.72,80.96 66.04,80.96 66.99,81.92 66.99,83.82 67.63,84.45 69.22,84.45 70.17,83.5 70.17,75.56 67.31,72.71 50.8,72.71 47.62,69.53 47.62,68.58 46.36,67.31 44.77,67.31
N$35
  pour Bottom (no thermals): 32.07,95.89 32.07,94.93 34.29,92.71 34.29,83.19 35.88,81.6 52.07,81.6 52.7,82.23 52.7,91.44 51.12,93.03 42.55,93.03 41.59,93.98 41.59,96.2 40.64,97.16 33.34,97.16
RTDS_5V  (via drill 0.6)
  Top 0.61: R2.2 35.24,108.78 Q6.1 35.24,104.3 37.46,102.08 37.46,86.84 35.08,84.45 35.08,73.18 35.4,72.87 45.24,72.87 48.1,70.01 v48.26,65.09 | v41.91,49.21 v44.45,49.21
  Bottom 0.61: U$17.D9 35.62,34.99 38.1,37.47 38.1,39.37 39.37,40.64 40.64,40.64 42.23,42.23 42.23,48.9 v41.91,49.21 | v44.45,49.21 44.45,64.14 45.4,65.09 v48.26,65.09
SCL_5V  (via drill 0.6)
  Top 0.61: R6.1 34.29,48.9 35.56,50.16 U$17.D21/SCL | U$21.PIN11 50.26,116.62 47.94,114.3 41.28,114.3 39.69,112.71 39.69,85.88 37.46,83.66 v37.46,75.56
  Bottom 0.61: v37.46,75.56 41.28,75.56 42.23,74.61 42.23,51.75 40.64,50.16 U$17.D21/SCL
SDA_5V  (via drill 0.6)
  Top 0.61: R1.1 31.5,51.75 U$17.D20/SDA | U$21.PIN12 40.13,116.65 38.74,115.25 38.74,86.68 36.35,84.3 v36.35,74.3
  Bottom 0.61: v36.35,74.3 40.64,74.3 41.28,73.66 41.28,53.02 39.69,51.44 34.29,51.44 33.08,50.23 U$17.D20/SDA
SEVCON+
  pour Top (no thermals): 87.95,117.47 87.95,113.03 90.49,110.49 90.49,106.68 91.12,106.05 92.39,106.05 93.66,107.31 93.66,116.84 91.76,118.75 89.22,118.75
SOC  (via drill 0.6)
  Top 0.61: v23.81,20.32 29.53,20.32 32.39,23.18 40.96,23.18 41.91,24.13 69.22,24.13 71.75,26.67 72.71,26.67 73.98,27.94 v73.98,32.38 | BMS_MAIN.13 91,46.8 89.53,48.26 74.61,48.26 73.98,47.62 v73.98,45.88
  Bottom 0.61: v23.81,20.32 3.49,20.32 2.86,20.95 2.86,22.2 U$17.A0 | v73.98,45.88 v73.98,32.38
START_INPUT  (via drill 0.6)  (1 unrouted)
  Top 0.61: v19.05,37.47 19.05,62.55 17.14,64.45 12.7,64.45 10.79,66.36 10.79,67.63 9.21,69.22 v4.92,69.22 | v2.7,83.66 v6.67,83.66
  Bottom 0.61: U$17.D10 v19.05,37.47 | v4.92,69.22 2.7,71.44 v2.7,83.66 | U$21.PIN32 58.26,119.54 60.17,117.63 60.17,115.73 59.06,114.62 | v6.67,83.66 10.95,83.66 11.75,84.45 11.75,100.65 12.22,101.12
TSMS_5V
  Top 0.61: U$18.4 21.27,65.09 23.81,62.55 23.81,30.48 25.72,28.57 34.35,28.57 U$17.D3
TSMS_12V  (via drill 0.6)
  Top 0.61: U$18.5 23.81,70.8 22.54,72.07 v22.54,79.85 | v16.19,113.98 20.64,118.43 21.27,118.43 22.54,119.7 22.54,121.28 26.35,125.09 42.7,125.09 v43.5,124.3
  Bottom 0.61: v16.19,113.98 16.19,104.46 19.68,100.97 19.68,84.45 22.54,81.6 v22.54,79.85 | U$21.PIN34 49.24,124.65 46.99,122.4 45.24,122.4 43.97,123.67 v43.5,124.3
UGLOW+
  Top 1.016: U$21.PIN27 78.26,128.75 76.52,130.49 14.61,130.49 3.81,119.7 3.81,97.79 6.35,95.25 UGLOW_FUSE.P$1
UGLOW-  (via drill 0.9)
  Top 1.27: v48.58,49.53 v59.06,49.53 | v69.85,56.83 v73.98,52.7 | v80.96,61.59 80.96,67.63 77.79,70.8 77.79,96.52 74.3,100.01 74.3,114.3
  Bottom 1.27: Q7.2 49.21,22.86 45.72,26.35 45.72,40.64 48.58,43.5 v48.58,49.53 | v59.06,49.53 59.06,54.61 61.28,56.83 v69.85,56.83 | v73.98,52.7 80.01,52.7 81.6,54.29 80.96,55.24 v80.96,61.59
  pour Top (no thermals): 71.12,121.13 77.15,121.13 77.15,113.35 74.61,113.35 71.12,120.02
UGLOW_5V
  Top 0.61: Q7.1 46.67,17.91 R3.2
  Bottom 0.61: Q7.1 42.86,20.95 39.05,24.77 39.05,33.02 38.42,33.66 34.35,33.66 U$17.D8
V+L
  pour Bottom (no thermals): 80.64,79.69 80.64,71.75 81.28,71.12 82.87,71.12 83.5,71.75 83.5,76.83 85.09,78.42 97.16,78.42 99.69,75.88 99.69,57.78 98.42,56.52 95.88,56.52 95.88,53.98 101.6,53.98 103.19,55.56 103.19,78.42 99.06,82.55 83.5,82.55
V+S  (via drill 0.9)
  other vias: 96.68,75.88 96.68,73.98 98.27,74.93 98.27,73.03 96.68,72.07
  pour Bottom: 89.22,77.15 97.16,77.15 99.06,75.25 99.06,71.12 89.22,71.12
  pour Top (no thermals): 95.88,49.85 98.11,49.85 99.06,50.8 99.06,75.25 97.16,77.15 95.88,77.15 95.88,67.94 93.34,65.41 93.34,51.12 94.61,49.85

### Text on the board
tNames: DAQ | DAQ | RTDS | SEVCON | COOLNT | FAN | UGLOW | LAP | IMD | COIL | BMS | BRAKE | TUFTS RACING | GLV MOTHERBOARD V2.0 | NOV 2016 | NOEL HWANG